# EAGLE schematic Module_20200404_0_7SigDisplay (EAGLE 9.3.2)
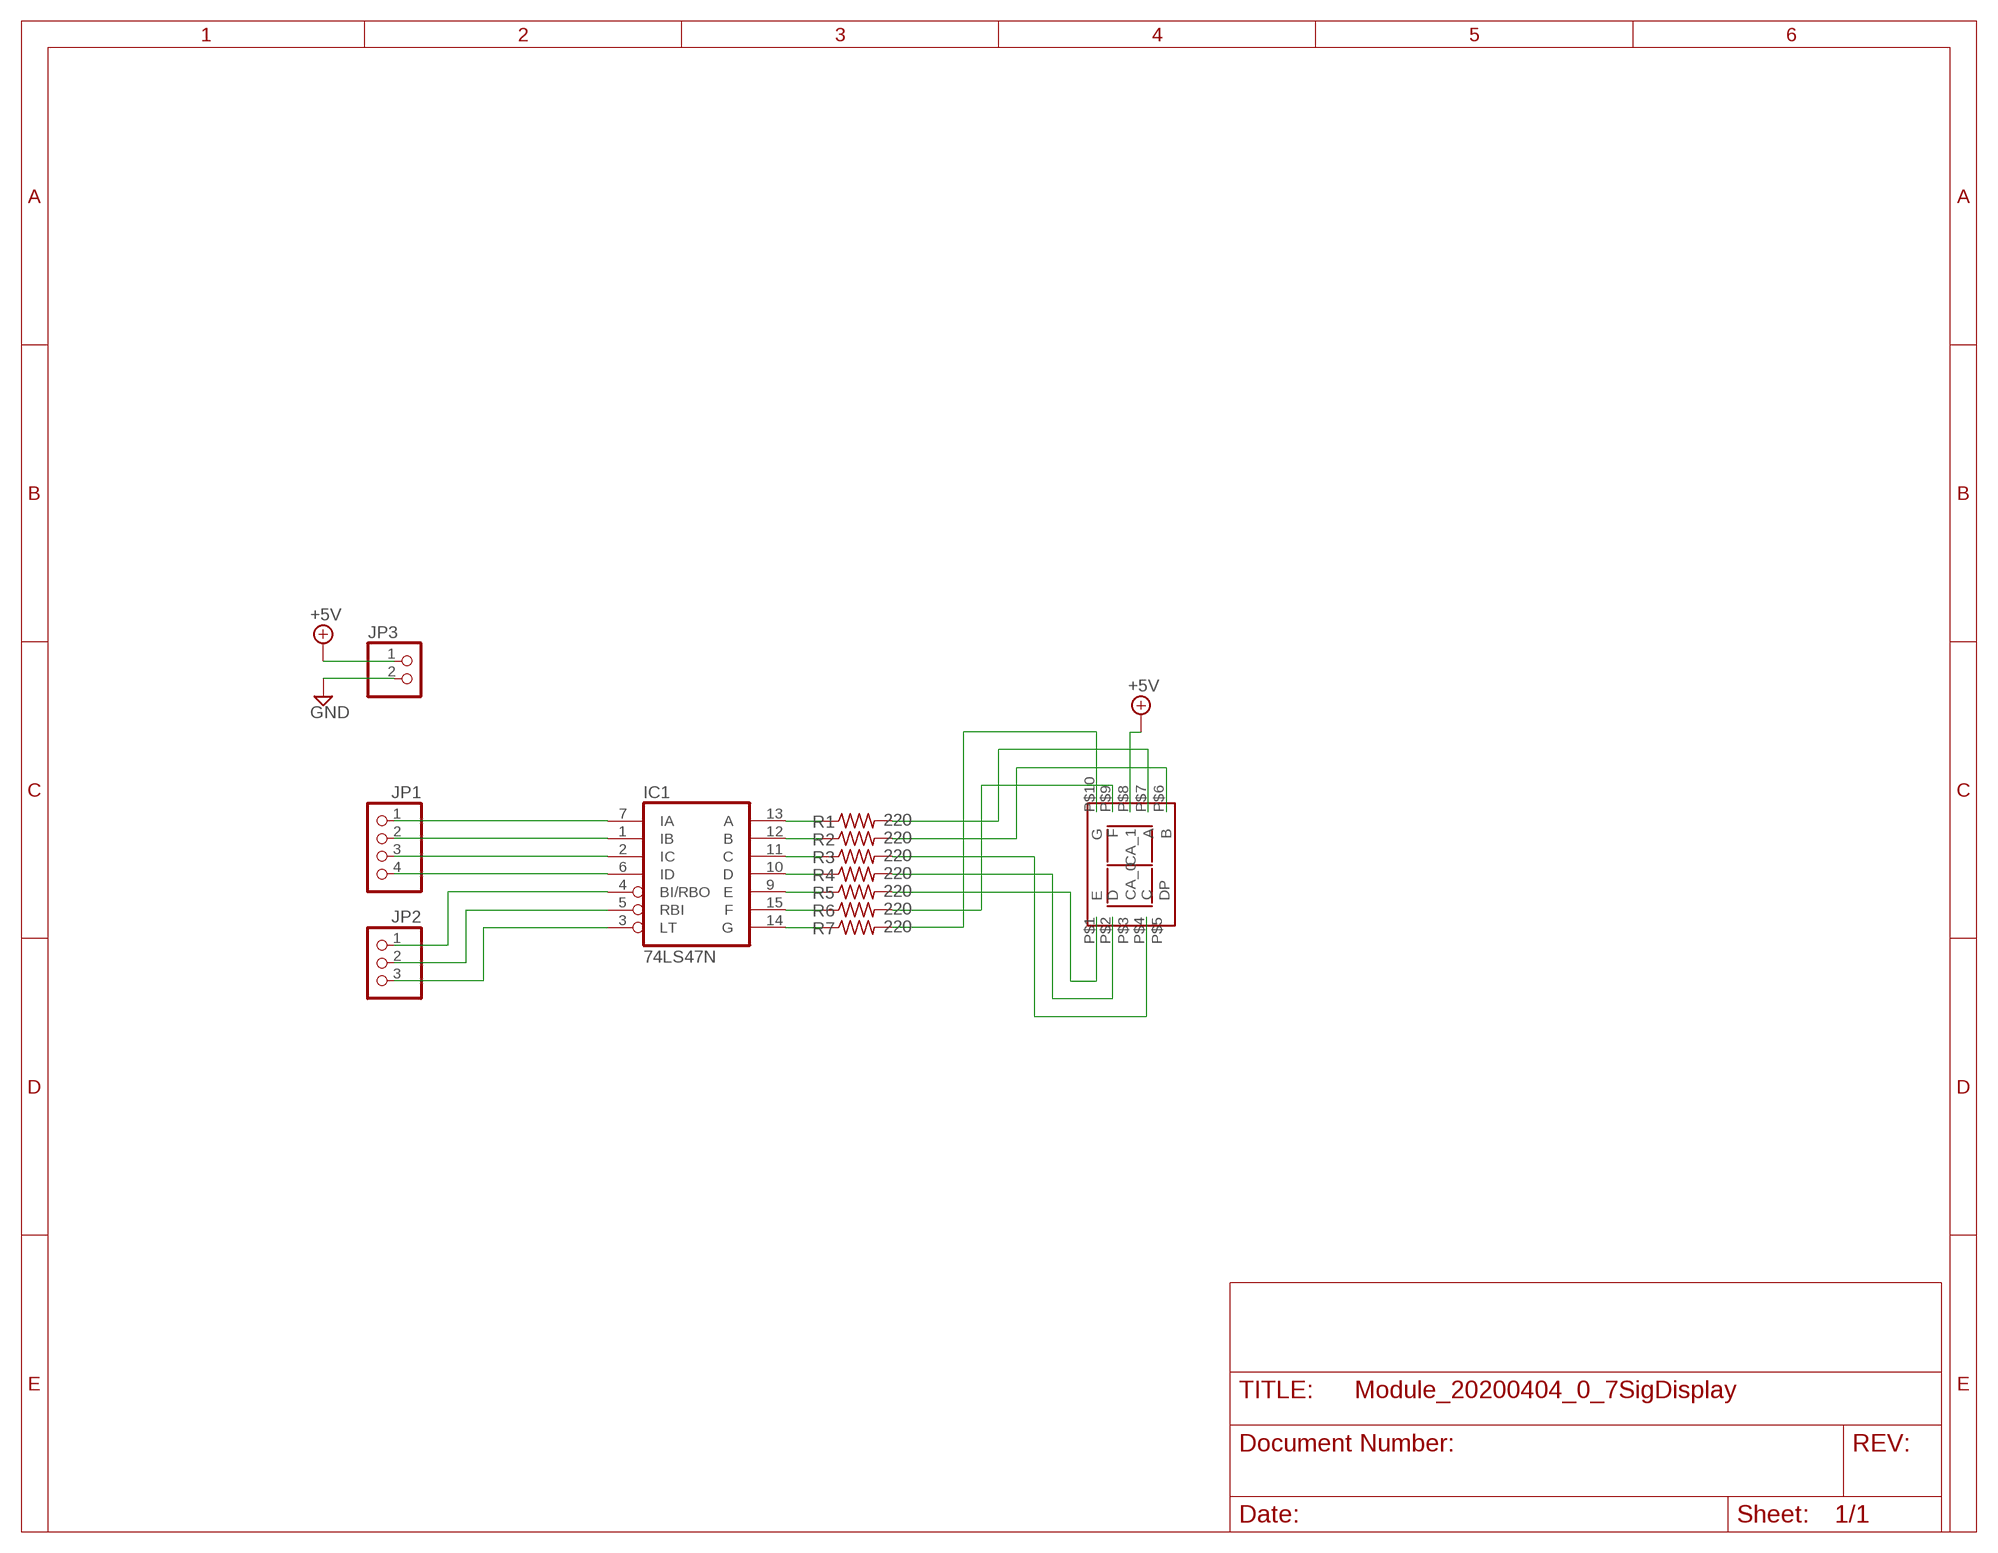
[diagram p0: schematic, sheet 1]

## Parts
IC1  74LS47N  [DIL16]
JP1  PINHD-1X4  [1X04]
JP2  PINHD-1X3  [1X03]
JP3  PINHD-1X2  [1X02]
R1  220  R-US_0207/12  [0207/12]
R2  220  R-US_0207/12  [0207/12]
R3  220  R-US_0207/12  [0207/12]
R4  220  R-US_0207/12  [0207/12]
R5  220  R-US_0207/12  [0207/12]
R6  220  R-US_0207/12  [0207/12]
R7  220  R-US_0207/12  [0207/12]
U$1  CSS-516E  [CSS-516E]

## Nets
+5V: JP3.1 U$1.P$8(CA_1)
GND: JP3.2
N$1: IC1.13(A) R1.1
N$2: IC1.12(B) R2.1
N$3: IC1.11(C) R3.1
N$4: IC1.10(D) R4.1
N$5: IC1.9(E) R5.1
N$6: IC1.15(F) R6.1
N$7: IC1.14(G) R7.1
N$8: R1.2 U$1.P$7(A)
N$9: R2.2 U$1.P$6(B)
N$10: R3.2 U$1.P$4(C)
N$11: R4.2 U$1.P$2(D)
N$12: R5.2 U$1.P$1(E)
N$13: R6.2 U$1.P$9(F)
N$14: R7.2 U$1.P$10(G)
N$15: IC1.7(IA) JP1.1
N$16: IC1.1(IB) JP1.2
N$17: IC1.2(IC) JP1.3
N$18: IC1.6(ID) JP1.4
N$19: IC1.4(BI/RBO) JP2.1
N$20: IC1.5(RBI) JP2.2
N$21: IC1.3(LT) JP2.3
Unconnected: U$1.P$5(DP)

## Power pins joined to a net without a drawn wire
CA_0: U$1.P$3(CA_0)
GND: IC1.8(GND)
VCC: IC1.16(VCC)

## Library data of the parts
IC1 = 74xx-eu:74*47: BCD to seven segment DECODER/DRIVER Source: http://www.ee.washington.edu/stores/DataSheets/74ls/74ls47.pdf
JP1 = pinhead:PINHD-1X4: PIN HEADER
JP2 = pinhead:PINHD-1X3: PIN HEADER
JP3 = pinhead:PINHD-1X2: PIN HEADER
R1-R7 = rcl:R-US_: RESISTOR, American symbol; SPICEPREFIX: R
U$1 = CSS_516E:CSS-516E